# Altium schematic sheet 5V Regulator.SchDoc
size A; SheetNumber: 11; SheetTotal: 11
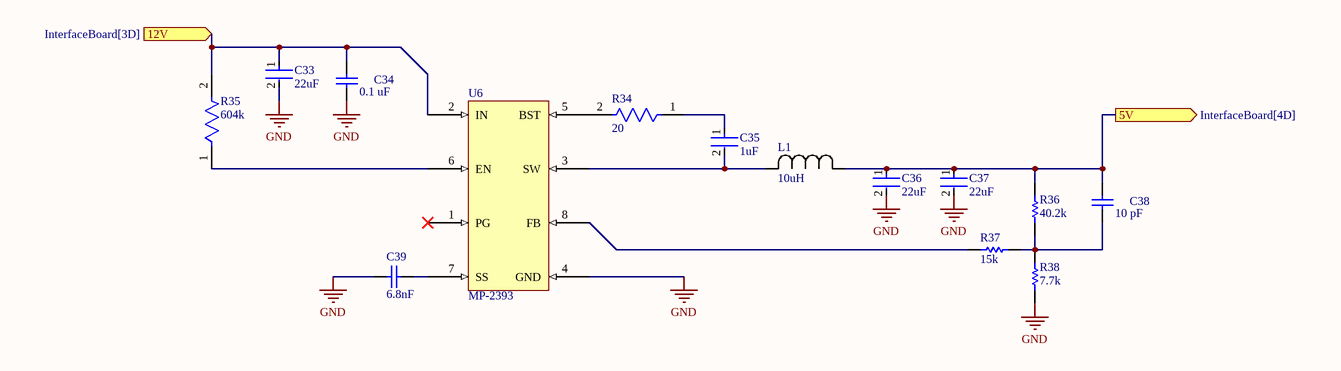
[diagram p0: 5V Regulator.SchDoc]

## Parts
C33  22uF  [FP-0603-L_1_6_0_2-W_0_8_0-IPC_B]
C34  0.1 uF  [CAPC1608X90X35NL15T15]
C35  1uF  [FP-0603-L_1_6_0_15-W_0_8-IPC_B]
C36  22uF  [FP-0603-L_1_6_0_2-W_0_8_0-IPC_B]
C37  22uF  [FP-0603-L_1_6_0_2-W_0_8_0-IPC_B]
C38  10 pF  [CAPC1608X90X35NL15T15]
C39  6.8nF  [CAPC1608X90X35NL15T15]
L1  10uH  [IND_TAIYO_NR8040_TAY]
R34  20  [FP-RT0603-MFG]
R35  604k  [FP-RT0603-MFG]
R36  40.2k  [RESC1609X55X30ML10T20]
R37  15k  [RESC1609X55X30ML10T20]
R38  7.7k  [RESC1609X55X30ML10T20]
U6  MP-2393  [MP-2393]

## Ports
5V (out, see InterfaceBoard[4D]), 12V (in, see InterfaceBoard[3D])

## Nets
GND: C33.2 C34.1 C36.2 C37.2 C39.1 R38.1 U6.4(GND)
5V: C36.1 C37.1 C38.2 L1.1 R36.2 ; port 5V
12V: C33.1 C34.2 R35.2 U6.2(IN) ; port 12V
NetC35_1: C35.1 R34.1
NetC35_2: C35.2 L1.2 U6.3(SW)
NetC38_1: C38.1 R36.1 R37.2 R38.2
NetC39_2: C39.2 U6.7(SS)
NetR34_2: R34.2 U6.5(BST)
NetR35_1: R35.1 U6.6(EN)
NetR37_1: R37.1 U6.8(FB)

Not connected (* = marked no-connect by the designer): U6 1(PG)*

## Notes on the sheet
- I estimated ~1.5A roughly for the 5V output (very approximate). The current ripple with 10uH is then about 0.45A. If the current needed is in reality less, then the ripple could be too large in comparison. Also, output current needs to be less than inductor sat current

## Library data of the parts
C33 C36 C37 = CMP-14477-000010-3: 0603; Voltage Rating: 10V; Tolerance: 20%; Case Code (Metric): 1608; Max Operating Temperature: 85°C; Min Operating Temperature: -55°C; RoHS Compliant: Yes; Case Code (Imperial): 0603; Mount: Surface Mount; Case/Package: 0603; Packaging: Cut Tape; Capacitance: 22uF
C34 C38 C39 = CMP-2006-02157-1: 0603 (1608 metric); Manufacturer: AVX Interconnect / Elco; Part Number: LD033C104KAB2A
C35 = CMP-14477-003841-2: None; Voltage Rating: 25V; Tolerance: 20%; Thickness: 0.037inch; RoHS Compliant: Yes; Mount: Surface Mount; Capacitance: 1uF; Length: 0.063inch; Case/Package: 0603; Max Operating Temperature: 125°C; Packaging: Tape and Reel; Width: 0.031inch; Ratings: AEC-Q200; Min Operating Temperature: -55°C
L1 = NR8040T100M: No Description Available; Manufacturer_Name: TAIYO YUDEN; Copyright: Copyright (C) 2025 Ultra Librarian. All rights reserved.; Manufacturer_Part_Number: NR8040T100M
R34 R35 = CMP-03412-028997-1: RES SMD 604K OHM 1% 1/10W 0603; Manufacturer Part Number: RT0603FRE07604KL; Manufacturer: Yageo; Power Rating: 0.1W; Temperature Coefficient: 50 ppm/°C; Voltage Rating: 75V; Tolerance: 0.01; Value: 604KΩ; Series: RT; Temperature Range High: +155°C; RoHS: TRUE; Ipc Land Pattern Name: RESC16080X45; Footprint Url: http://www.yageo.com/exep/pages/download/literatures/PYu-R_Mount_10.pdf; ComponentLink2Description: Datasheet; Device Class L3: Chip SMD Resistors; Digikey Description: RES SMD 604K OHM 1% 1/10W 0603; Device Class L1: Passive Components; ComponentLink2URL: http://www.yageo.com/documents/recent/PYu-RT_1-to-0.01_RoHS_L_9.pdf; Temperature Range Low: -55°C; Category: Res; Lead Free: Yes; Package: RT0603; Octopart: https://octopart.com/rt0603fre07604kl-yageo-26041741; Automotive: No; Composition: Thin Film; Height: 0.55mm; Temperature: -55°C to +155°C; Mouser Description: High Precision-High Stability Chip Resistor Thin Film 0603 604kOhm 1% Paper T/R; Resistance: 604KΩ; Device Class L2: Resistors
R36-R38 = CMP-2000-03706-1: 0603; Manufacturer: Vishay Dale; Part Number: TNPW060313K3BEEA
U6 = MP-2393: https://www.monolithicpower.com/en/documentview/productdocument/index/version/2/document_type/Datasheet/lang/en/sku/MP2393GTL-Z/document_id/4270/